# EAGLE board dashboard (EAGLE 8.0.1)
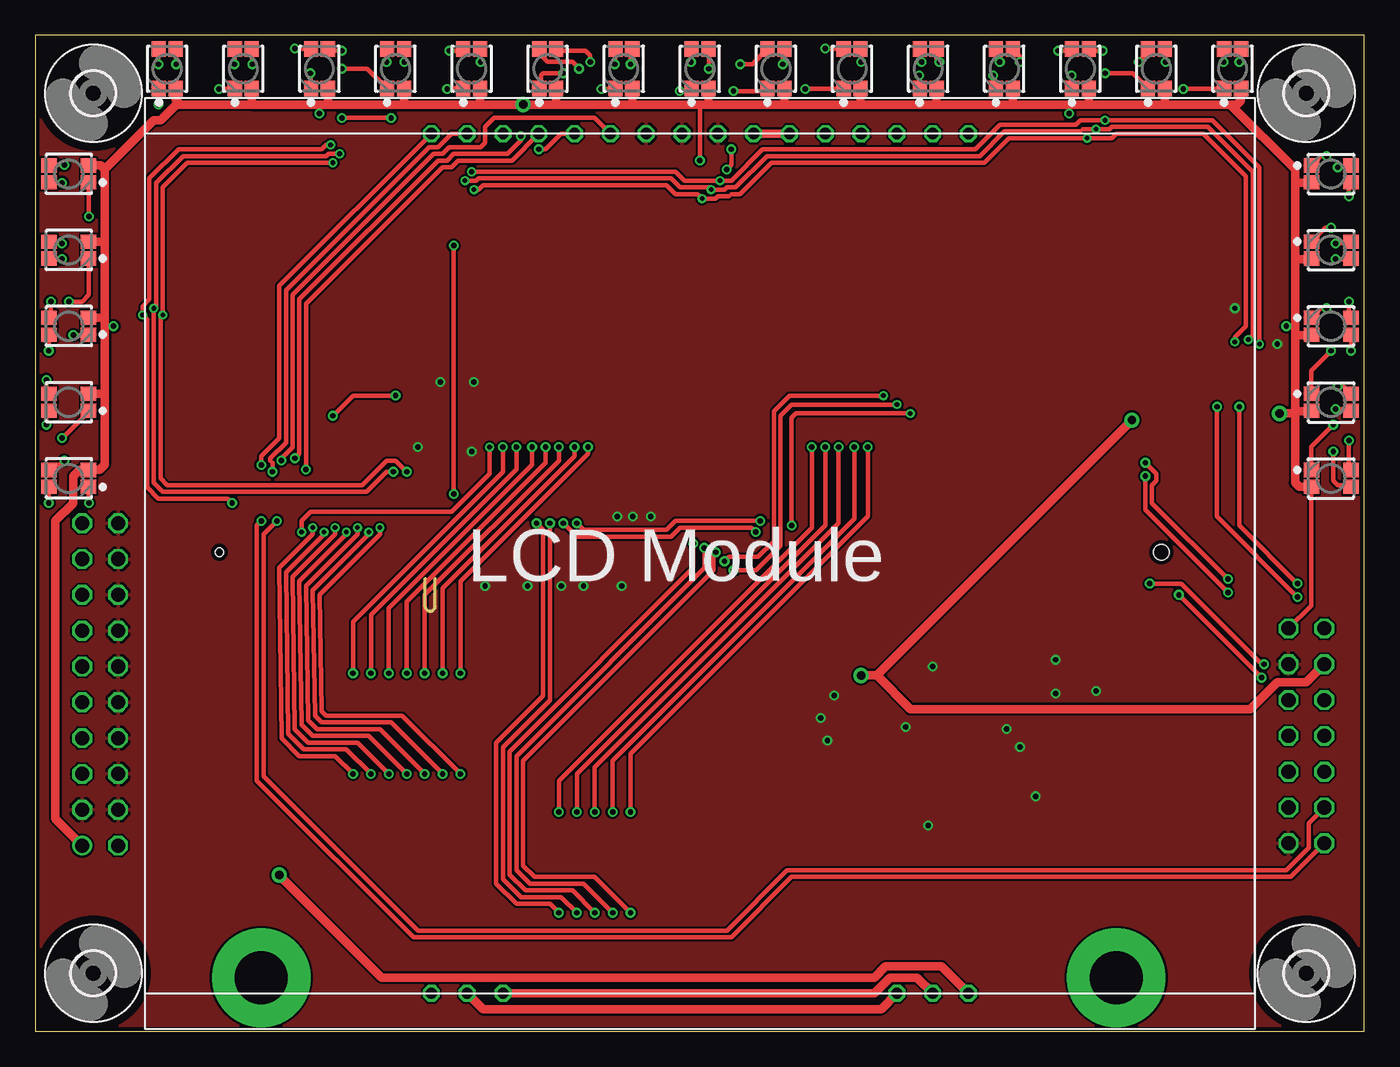
[diagram p3: board, top side]
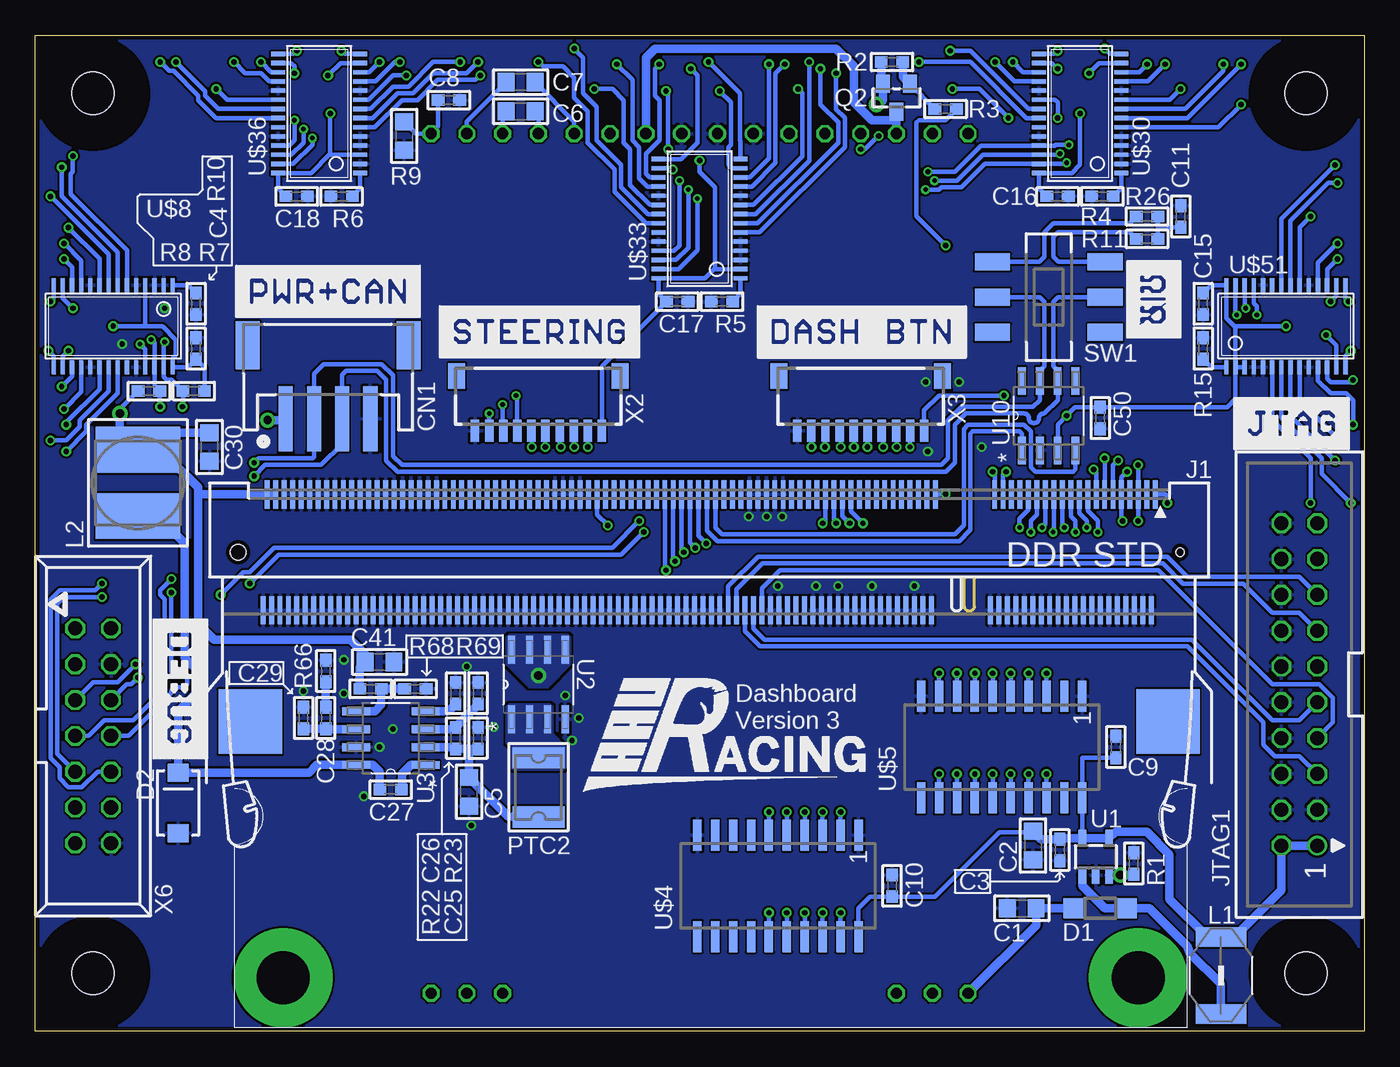
[diagram p4: board, bottom side, seen from below]

Size 94.27 x 70.64 mm. Coordinates in mm from the lower left corner, seen from the top.
Outline: 0,0 94.27,0 94.27,70.64 0,70.64 0,0
Copper layers (1*16): Top 0.035mm / dielectric 1.5mm / Bottom 0.035mm
Design rules "PCB-POOL Standard": minimum track width 0.15mm, minimum drill 0.3mm, track to track 0.15mm, track to pad 0.15mm, pad to pad 0.15mm, via to via 0.15mm, smd to smd 0.15mm, copper to edge 0.3mm, drill to drill 0.2mm, minimum pad ring 0.2mm, minimum via ring 0.15mm, stop-mask expansion 0.075mm, vias tented up to drill 0mil, thermal gap 0.2mm

## Footprints (pad centres in the part's own frame; a part is rotated, then mirrored left to right if it is on the bottom)
_0805 = smd 1.2 x 1.3: 1 -1.016,0; 2 1.016,0
_0603 = smd 0.9 x 0.8: 1 -0.762,0; 2 0.762,0
JSTPH4 = smd 1 x 4.6: 1 -3,-3.7; 2 -1,-3.7; 3 1,-3.7; 4 3,-3.7 | smd 1.7 x 3.4: NC1 -5.7,1.5; NC2 5.7,1.5
SOD123 = smd 1.4 x 1.4: A 1.9,0; C -1.9,0
SMA-DIODE = smd 1.27 x 1.47: A -2.15,0; C 2.15,0
3,0 = hole 3: 0,0
SODIMM-CONNECTOR-2.5V = smd 0.35 x 2: 1 28.84,18.07; 2 28.54,9.87; 3 28.24,18.07; 4 27.94,9.87; 5 27.64,18.07; 6 27.34,9.87; 7 27.04,18.07; 8 26.74,9.87; 9 26.44,18.07; 10 26.14,9.87; 11 25.84,18.07; 12 25.54,9.87; 13 25.24,18.07; 14 24.94,9.87; 15 24.64,18.07; 16 24.34,9.87; 17 24.04,18.07; 18 23.74,9.87; 19 23.44,18.07; 20 23.14,9.87; 21 22.84,18.07; 22 22.54,9.87; 23 22.24,18.07; 24 21.94,9.87; 25 21.64,18.07; 26 21.34,9.87; 27 21.04,18.07; 28 20.74,9.87; 29 20.44,18.07; 30 20.14,9.87; 31 19.84,18.07; 32 19.54,9.87; 33 19.24,18.07; 34 18.94,9.87; 35 18.64,18.07; 36 18.34,9.87; 37 18.04,18.07; 38 17.74,9.87; 39 17.44,18.07; 40 17.14,9.87; 41 13.24,18.07; 42 12.94,9.87; 43 12.64,18.07; 44 12.34,9.87; 45 12.04,18.07; 46 11.74,9.87; 47 11.44,18.07; 48 11.14,9.87; 49 10.84,18.07; 50 10.54,9.87; 51 10.24,18.07; 52 9.94,9.87; 53 9.64,18.07; 54 9.34,9.87; 55 9.04,18.07; 56 8.74,9.87; 57 8.44,18.07; 58 8.14,9.87; 59 7.84,18.07; 60 7.54,9.87; 61 7.24,18.07; 62 6.94,9.87; 63 6.64,18.07; 64 6.34,9.87; 65 6.04,18.07; 66 5.74,9.87; 67 5.44,18.07; 68 5.14,9.87; 69 4.84,18.07; 70 4.54,9.87; 71 4.24,18.07; 72 3.94,9.87; 73 3.64,18.07; 74 3.34,9.87; 75 3.04,18.07; 76 2.74,9.87; 77 2.44,18.07; 78 2.14,9.87; 79 1.84,18.07; 80 1.54,9.87; 81 1.24,18.07; 82 0.94,9.87; 83 0.64,18.07; 84 0.34,9.87; 85 0.04,18.07; 86 -0.26,9.87; 87 -0.56,18.07; 88 -0.86,9.87; 89 -1.16,18.07; 90 -1.46,9.87; 91 -1.76,18.07; 92 -2.06,9.87; 93 -2.36,18.07; 94 -2.66,9.87; 95 -2.96,18.07; 96 -3.26,9.87; 97 -3.56,18.07; 98 -3.86,9.87; 99 -4.16,18.07; 100 -4.46,9.87; 101 -4.76,18.07; 102 -5.06,9.87; 103 -5.36,18.07; 104 -5.66,9.87; 105 -5.96,18.07; 106 -6.26,9.87; 107 -6.56,18.07; 108 -6.86,9.87; 109 -7.16,18.07; 110 -7.46,9.87; 111 -7.76,18.07; 112 -8.06,9.87; 113 -8.36,18.07; 114 -8.66,9.87; 115 -8.96,18.07; 116 -9.26,9.87; 117 -9.56,18.07; 118 -9.86,9.87; 119 -10.16,18.07; 120 -10.46,9.87; 121 -10.76,18.07; 122 -11.06,9.87; 123 -11.36,18.07; 124 -11.66,9.87; 125 -11.96,18.07; 126 -12.26,9.87; 127 -12.56,18.07; 128 -12.86,9.87; 129 -13.16,18.07; 130 -13.46,9.87; 131 -13.76,18.07; 132 -14.06,9.87; 133 -14.36,18.07; 134 -14.66,9.87; 135 -14.96,18.07; 136 -15.26,9.87; 137 -15.56,18.07; 138 -15.86,9.87; 139 -16.16,18.07; 140 -16.46,9.87; 141 -16.76,18.07; 142 -17.06,9.87; 143 -17.36,18.07; 144 -17.66,9.87; 145 -17.96,18.07; 146 -18.26,9.87; 147 -18.56,18.07; 148 -18.86,9.87; 149 -19.16,18.07; 150 -19.46,9.87; 151 -19.76,18.07; 152 -20.06,9.87; 153 -20.36,18.07; 154 -20.66,9.87; 155 -20.96,18.07; 156 -21.26,9.87; 157 -21.56,18.07; 158 -21.86,9.87; 159 -22.16,18.07; 160 -22.46,9.87; 161 -22.76,18.07; 162 -23.06,9.87; 163 -23.36,18.07; 164 -23.66,9.87; 165 -23.96,18.07; 166 -24.26,9.87; 167 -24.56,18.07; 168 -24.86,9.87; 169 -25.16,18.07; 170 -25.46,9.87; 171 -25.76,18.07; 172 -26.06,9.87; 173 -26.36,18.07; 174 -26.66,9.87; 175 -26.96,18.07; 176 -27.26,9.87; 177 -27.56,18.07; 178 -27.86,9.87; 179 -28.16,18.07; 180 -28.46,9.87; 181 -28.76,18.07; 182 -29.06,9.87; 183 -29.36,18.07; 184 -29.66,9.87; 185 -29.96,18.07; 186 -30.26,9.87; 187 -30.56,18.07; 188 -30.86,9.87; 189 -31.16,18.07; 190 -31.46,9.87; 191 -31.76,18.07; 192 -32.06,9.87; 193 -32.36,18.07; 194 -32.66,9.87; 195 -32.96,18.07; 196 -33.26,9.87; 197 -33.56,18.07; 198 -33.86,9.87; 199 -34.16,18.07; 200 -34.46,9.87 | smd 4.5 x 4.6: M1 29.74,1.97; M2 -35.36,1.97 | drill 3.75 pad 7: P$1 -33.02,-16.192; P$2 27.622,-16.192 | hole 0.6: 30.59,13.97 | hole 1.1: -36.21,13.97
JTAG-ARM = drill 1: 1 -11.43,-1.27 | drill 1 octagon: 2 -11.43,1.27; 3 -8.89,-1.27; 4 -8.89,1.27; 5 -6.35,-1.27; 6 -6.35,1.27; 7 -3.81,-1.27; 8 -3.81,1.27; 9 -1.27,-1.27; 10 -1.27,1.27; 11 1.27,-1.27; 12 1.27,1.27; 13 3.81,-1.27; 14 3.81,1.27; 15 6.35,-1.27; 16 6.35,1.27; 17 8.89,-1.27; 18 8.89,1.27; 19 11.43,-1.27; 20 11.43,1.27
S = smd 1.4 x 3.56: 1 -2.73,0; 2 2.73,0
INDUCTOR_6X6MM_TDK_VLC6045 = smd 3.25 x 6: P$1 -2.35,0; P$2 2.35,0
RGBLED_PLCC4 = smd 1.1 x 1: 1 -1.4,0.6; 2 -1.4,-0.6; 3 1.4,-0.6; 4 1.4,0.6
PTC1812 = smd 1.5 x 3.7: P$1 -2.1,0; P$2 2.1,0
SOT23-WIDE = smd 1 x 1.27: 1 -0.95,-1; 2 0.95,-1; 3 0,1
DPDT_SMT_JS202011SCQN = smd 1.2 x 2.5: P$1 -2.5,-4; P$2 0,-4; P$3 2.5,-4; P$4 2.5,4; P$5 0,4; P$6 -2.5,4
SOT23-5 = smd 0.55 x 1.2: 1 -0.95,-1.3; 2 0,-1.3; 3 0.95,-1.3; 4 0.95,1.3; 5 -0.95,1.3
SOIC127P600X175-8N = smd 1.981 x 0.508: 1 -2.464,1.905; 2 -2.464,0.635; 3 -2.464,-0.635; 4 -2.464,-1.905; 5 2.464,-1.905; 6 2.464,-0.635; 7 2.464,0.635; 8 2.464,1.905
SOIC127P600X175-8N' = smd 1.981 x 0.559: 1 -2.464,1.905; 2 -2.464,0.635; 3 -2.464,-0.635; 4 -2.464,-1.905; 5 2.464,-1.905; 6 2.464,-0.635; 7 2.464,0.635; 8 2.464,1.905
SOP20 = smd 0.6 x 2.2: 1 -5.715,-3.6; 2 -4.445,-3.6; 3 -3.175,-3.6; 4 -1.905,-3.6; 5 -0.635,-3.6; 6 0.635,-3.6; 7 1.905,-3.6; 8 3.175,-3.6; 9 4.445,-3.6; 10 5.715,-3.6; 11 5.715,3.6; 12 4.445,3.6; 13 3.175,3.6; 14 1.905,3.6; 15 0.635,3.6; 16 -0.635,3.6; 17 -1.905,3.6; 18 -3.175,3.6; 19 -4.445,3.6; 20 -5.715,3.6
TSSOP28 = smd 0.305 x 0.991: 1 -4.225,-2.918; 2 -3.575,-2.918; 3 -2.925,-2.918; 4 -2.275,-2.918; 5 -1.625,-2.918; 6 -0.975,-2.918; 7 -0.325,-2.918; 8 0.325,-2.918; 9 0.975,-2.918; 10 1.625,-2.918; 11 2.275,-2.918; 12 2.925,-2.918; 13 3.575,-2.918; 14 4.225,-2.918; 15 4.225,2.918; 16 3.575,2.918; 17 2.925,2.918; 18 2.275,2.918; 19 1.625,2.918; 20 0.975,2.918; 21 0.325,2.918; 22 -0.325,2.918; 23 -0.975,2.918; 24 -1.625,2.918; 25 -2.275,2.918; 26 -2.925,2.918; 27 -3.575,2.918; 28 -4.225,2.918
EA-DOGXL160W-7 = drill 0.8 octagon: P$1 20.32,2.54; P$2 22.86,2.54; P$3 25.4,2.54; P$14 53.34,2.54; P$15 55.88,2.54; P$16 58.42,2.54; P$17 58.42,63.5; P$18 55.88,63.5; P$19 53.34,63.5; P$20 50.8,63.5; P$21 48.26,63.5; P$22 45.72,63.5; P$23 43.18,63.5; P$24 40.64,63.5; P$25 38.1,63.5; P$26 35.56,63.5; P$27 33.02,63.5; P$28 30.48,63.5; P$29 27.94,63.5; P$30 25.4,63.5; P$31 22.86,63.5; P$32 20.32,63.5
SM10B-SRSS-TB = smd 0.6 x 1.55: 1 -4.5,2.975; 2 -3.5,2.975; 3 -2.5,2.975; 4 -1.5,2.975; 5 -0.5,2.975; 6 0.5,2.975; 7 1.5,2.975; 8 2.5,2.975; 9 3.5,2.975; 10 4.5,2.975 | smd 1.2 x 1.8: FIT@1 -5.8,-0.9; FIT@2 5.8,-0.9
057-014-1 = drill 1 octagon: 1 -7.62,-1.27; 2 -7.62,1.27; 3 -5.08,-1.27; 4 -5.08,1.27; 5 -2.54,-1.27; 6 -2.54,1.27; 7 0,-1.27; 8 0,1.27; 9 2.54,-1.27; 10 2.54,1.27; 11 5.08,-1.27; 12 5.08,1.27; 13 7.62,-1.27; 14 7.62,1.27

## Placement (x,y rotation side)
C1  220n50V  [_0805]  24.29,8.73 180 bottom
C2  1u  [_0805]  23.5,13.18 270 bottom
C3  100n  [_0603]  21.59,12.86 270 bottom
C4  100n  [_0603]  82.87,48.42 90 bottom
C5  4,7u  [_0805]  63.5,16.99 270 bottom
C6  2u  [_0805]  59.85,65.25 180 bottom
C7  2u  [_0805]  59.85,67.31 180 bottom
C8  100n  [_0603]  64.93,66.04 180 bottom
C9  100n  [_0603]  17.62,20.16 90 bottom
C10  100n  [_0603]  33.5,10.32 90 bottom
C11  47n  [_0603]  13.02,57.78 90 bottom
C15  100n  [_0603]  11.43,51.59 270 bottom
C16  100n  [_0603]  21.75,59.21 0 bottom
C17  100n  [_0603]  48.74,51.75 0 bottom
C18  100n  [_0603]  75.72,59.21 0 bottom
C25  10n  [_0603]  62.87,20.8 90 bottom
C26  10n  [_0603]  64.45,23.97 90 bottom
C27  100n  [_0603]  69.06,17.14 0 bottom
C28  1n  [_0603]  73.66,22.23 90 bottom
C29  47p  [_0603]  75.25,22.23 90 bottom
C30  47u  [_0805]  81.92,41.43 270 bottom
C41  47u  [_0805]  69.85,26.19 0 bottom
C50  100n  [_0603]  18.73,43.5 270 bottom
CN1  [JSTPH4]  73.5,47.15 0 bottom
D1  MBR0520LT  [SOD123]  18.73,8.73 0 bottom
D2  BA340A  [SMA-DIODE]  84.14,16.19 90 bottom
H1  MOUNT-HOLE3.0  [3,0]  4.13,4.13 0 top
H2  MOUNT-HOLE3.0  [3,0]  90.17,4.13 0 top
H3  MOUNT-HOLE3.0  [3,0]  90.17,66.52 0 top
H4  MOUNT-HOLE3.0  [3,0]  4.13,66.52 0 top
J1  SO-DIMM-CPU  [SODIMM-CONNECTOR-2.5V]  43.66,20 0 bottom
JTAG1  JTAG-ARM  [JTAG-ARM]  4.6,24.61 90 bottom
L1  WE-PD4S  [S]  10.16,3.97 90 bottom
L2  SRN6045TA-680M  [INDUCTOR_6X6MM_TDK_VLC6045]  87,38.89 90 bottom
LED1  [RGBLED_PLCC4]  9.37,68.26 90 top
LED2  [RGBLED_PLCC4]  14.76,68.26 90 top
LED3  [RGBLED_PLCC4]  20.16,68.26 90 top
LED4  [RGBLED_PLCC4]  25.56,68.26 90 top
LED5  [RGBLED_PLCC4]  30.96,68.26 90 top
LED6  [RGBLED_PLCC4]  36.35,68.26 90 top
LED7  [RGBLED_PLCC4]  41.75,68.26 90 top
LED8  [RGBLED_PLCC4]  47.15,68.26 90 top
LED9  [RGBLED_PLCC4]  52.55,68.26 90 top
LED10  [RGBLED_PLCC4]  57.94,68.26 90 top
LED11  [RGBLED_PLCC4]  63.34,68.26 90 top
LED12  [RGBLED_PLCC4]  68.74,68.26 90 top
LED13  [RGBLED_PLCC4]  74.14,68.26 90 top
LED14  [RGBLED_PLCC4]  79.53,68.26 90 top
LED15  [RGBLED_PLCC4]  84.93,68.26 90 top
LED16  [RGBLED_PLCC4]  2.38,39.21 180 top
LED17  [RGBLED_PLCC4]  2.38,44.61 180 top
LED18  [RGBLED_PLCC4]  2.38,50.01 180 top
LED19  [RGBLED_PLCC4]  2.38,55.4 180 top
LED20  [RGBLED_PLCC4]  2.38,60.8 180 top
LED21  [RGBLED_PLCC4]  91.92,60.8 0 top
LED22  [RGBLED_PLCC4]  91.92,55.4 0 top
LED23  [RGBLED_PLCC4]  91.92,50.01 0 top
LED24  [RGBLED_PLCC4]  91.92,44.61 0 top
LED25  [RGBLED_PLCC4]  91.92,39.21 0 top
PTC2  [PTC1812]  58.58,17.3 90 bottom
Q2  [SOT23-WIDE]  33.18,66.2 180 bottom
R1  15  [_0603]  16.35,11.91 90 bottom
R2  1k  [_0603]  33.5,68.74 0 bottom
R3  220  [_0603]  29.69,65.41 0 bottom
R4  931  [_0603]  18.57,59.21 180 bottom
R5  931  [_0603]  45.56,51.75 180 bottom
R6  931  [_0603]  72.55,59.21 180 bottom
R7  500  [_0603]  83.03,45.4 0 bottom
R8  500  [_0603]  86.2,45.4 180 bottom
R9  10m  [_0805]  68.1,63.5 90 bottom
R10  931  [_0603]  82.87,51.59 270 bottom
R11  60  [_0603]  15.4,56.2 0 bottom
R15  931  [_0603]  11.43,48.42 90 bottom
R22  332k  [_0603]  64.45,20.8 90 bottom
R23  68k1  [_0603]  62.87,23.97 90 bottom
R26  60  [_0603]  15.4,57.78 180 bottom
R66  29k4  [_0603]  73.66,25.56 90 bottom
R68  10k2  [_0603]  70.48,24.29 0 bottom
R69  3k24  [_0603]  67.31,24.29 0 bottom
SW1  [DPDT_SMT_JS202011SCQN]  22.38,52.07 90 bottom
U1  CAT4238TD-GT3  [SOT23-5]  19.05,12.38 0 bottom
U2  IRF9332PBF  [SOIC127P600X175-8N]  58.58,24.61 90 bottom
U3  TPS54331D  [SOIC127P600X175-8N']  69.06,20.8 180 bottom
U10  SN65HVD232D  [SOIC127P600X175-8N']  22.38,43.66 90 bottom
U$4  MAX6818  [SOP20]  41.59,10.32 180 bottom
U$5  MAX6818  [SOP20]  25.72,20.16 180 bottom
U$8  TLC59116  [TSSOP28]  88.74,50.01 180 bottom
U$10  EA-DOGXL160W-7  [EA-DOGXL160W-7]  7.78,0.16 0 top
U$30  TLC59116  [TSSOP28]  20.16,65.09 90 bottom
U$33  TLC59116  [TSSOP28]  47.15,57.63 90 bottom
U$36  TLC59116  [TSSOP28]  74.14,65.09 90 bottom
U$51  TLC59116  [TSSOP28]  5.56,50.01 0 bottom
X2  SM10B-SRSS-TB  [SM10B-SRSS-TB]  58.58,45.56 180 bottom
X3  SM10B-SRSS-TB  [SM10B-SRSS-TB]  35.72,45.56 180 bottom
X6  057-014-1  [057-014-1]  90.17,20.95 270 bottom

## Tracks (layer width: path | path; a pad name or v marks a point on that pad's centre or on a via)
3.3V  (via drill 0.38, 0.6)
  Top 0.305: v73.34,65.09 73.34,65.72 | v47.15,61.75 47.15,65.72 | v5.56,50.01 4.92,50.01 | X6.2 90.52,30.19 LED25.2 | v20.16,65.09 20.16,65.72 | v88.74,50.01 89.38,50.01 | v25.56,45.09 22.54,45.09 v21.11,43.66
  Top 0.61: 10.32,65.72 9.97,66.08 LED1.2 | 74.74,65.72 73.34,65.72 69.34,65.72 | 80.13,65.72 74.74,65.72 | 63.94,65.72 69.34,65.72 | 58.54,65.72 63.94,65.72 | 53.15,65.72 58.54,65.72 | 47.75,65.72 53.15,65.72 | 42.86,65.72 47.15,65.72 47.75,65.72 | 42.86,65.72 42.35,65.72 | 36.95,65.72 42.35,65.72 | 31.56,65.72 v34.61,65.72 36.95,65.72 | 26.51,65.72 26.16,65.72 | 26.51,65.72 31.56,65.72 | 20.76,65.72 26.16,65.72 | 15.36,65.72 20.16,65.72 20.76,65.72 | 15.36,65.72 10.32,65.72 | 84.77,65.72 80.13,65.72 | 84.77,65.72 85.25,65.72 85.53,66 LED15.2 | JTAG1.1 1.43,15.08 1.43,36.2 2.7,37.47 2.7,39.37 3.14,39.81 LED16.2 4.57,39.81 4.92,40.16 4.92,45.21 | 4.92,56 4.92,61.12 | 4.92,50.61 4.92,56 | 4.92,45.21 4.92,50.01 4.92,50.61 | 4.92,61.12 8.41,64.61 8.89,64.61 10,65.72 10.32,65.72 | LED20.2 4.64,61.4 4.92,61.12 | LED19.2 4.92,56 | LED18.2 4.92,50.61 | LED17.2 4.92,45.21 | LED25.2 89.66,38.61 89.38,38.89 89.38,43.97 | 89.38,54.77 89.38,60.17 | 89.38,49.37 89.38,50.01 89.38,54.77 | 89.38,43.97 89.38,49.37 | 89.38,60.17 89.38,61.12 84.77,65.72 | LED21.2 90.48,60.17 89.38,60.17 | LED22.2 90.48,54.77 89.38,54.77 | LED23.2 90.48,49.37 89.38,49.37 | LED24.2 90.48,43.97 89.38,43.97 | v88.27,43.81 89.22,43.81 89.38,43.97 | LED2.2 15.36,65.72 | LED3.2 20.76,65.72 | LED4.2 26.16,65.72 | 26.16,65.72 26.51,65.72 | LED5.2 31.56,65.72 | LED6.2 36.95,65.72 | LED7.2 42.35,65.72 | 42.35,65.72 42.86,65.72 | LED8.2 47.75,65.72 | LED9.2 53.15,65.72 | LED10.2 58.54,65.72 | LED11.2 63.94,65.72 | LED12.2 69.34,65.72 | LED13.2 74.74,65.72 | LED14.2 80.13,65.72
  Bottom 0.305: 46.04,54.05 46.11,54.05 46.76,53.4 U$33.28 50.07,52.32 C17.1 54.08,47.17 X2.1 | 46.04,54.05 U$33.2 | 9.21,50.01 9.78,50.58 U$51.28 10.86,52.92 C15.1 | 9.21,50.01 v5.56,50.01 | U$51.2 9.13,49.93 9.21,50.01 | U$51.3 U$51.2 | C18.1 77.05,59.78 U$36.28 74.71,60.86 73.34,62.23 | U$4.20 35.88,8.73 35.05,9.56 C10.1 30.45,9.56 25.88,14.13 23.56,14.13 C2.1 | C9.1 20,19.4 U$5.20 U1.5 | C16.1 23.08,59.78 U$30.28 20.73,60.86 20.16,61.44 v20.16,65.09 | 73.34,62.23 v73.34,65.09 | U$36.3 73.28,62.16 73.34,62.23 | v47.15,61.75 47.15,60.96 46.04,59.85 46.04,54.05 | 86.47,50.01 85.25,50.01 84.3,49.05 84.3,47.94 84.52,47.72 U$8.28 83.44,47.09 C4.1 82.26,47.05 R7.2 | 86.47,50.01 v88.74,50.01 | U$8.4 86.47,50.01 | R8.2 87,45.4 88.27,44.13 v88.27,43.81 | U10.3 21.75,43.02 v21.11,43.66 20.51,44.26 C50.1 9.72,44.26 9.13,44.84 U$51.2 | v25.56,45.09 30.16,45.09 31.22,44.03 X3.1
  Bottom 0.406: J1.197 J1.199
  Bottom 0.61: v34.61,65.72 34.45,65.72 34.13,66.04 Q2.2 34.26,67.33 R2.1 | C2.1 22.92,13.62 C3.1 21.53,13.68 U1.5 U1.4 17.62,14.16 15.43,14.16 13.81,12.54 13.81,9.37 11.14,6.7 L1.2 9.18,6.7 5.87,10 JTAG1.2 JTAG1.1 | v88.27,43.81 88.27,42.51 L2.P$2 | R68.1 71.25,25.81 C41.1 70.87,26.73 71.91,27.78 81.6,27.78 82.71,28.89 82.71,38.1 | 82.71,38.1 82.71,38.58 84.61,40.48 86.23,40.48 L2.P$2 | 82.71,38.1 82.68,38.07 J1.199 | C30.1 85.79,42.45 L2.P$2
12V
  Bottom 0.61: U3.2 64.58,20.16 R22.1 63.66,20.03 | 63.66,20.03 C25.1 62.83,20 | 63.66,20.03 63.5,19.88 C5.1 60.7,15.2 PTC2.P$1
BTN1  (via drill 0.38)
  Top 0.305: v37.15,8.41 36.51,9.05 34.13,9.05 32.7,10.48 32.7,20.48 36.04,23.81 36.04,35.56 v35.56,36.04
  Bottom 0.305: U$4.19 v37.15,8.41 | J1.61 36.42,36.89 v35.56,36.04
BTN2  (via drill 0.38)
  Top 0.305: v38.42,8.41 37.31,9.53 34.45,9.53 33.18,10.79 33.18,20.16 36.51,23.5 v36.51,36.04
  Bottom 0.305: U$4.18 v38.42,8.41 | J1.63 37.02,36.54 v36.51,36.04
BTN3  (via drill 0.38)
  Top 0.305: v39.69,8.41 38.1,10 34.77,10 33.66,11.11 33.66,19.84 46.67,32.86 v46.67,34.61
  Bottom 0.305: U$4.17 v39.69,8.41 | J1.97 47.22,35.15 v46.67,34.61
BTN4  (via drill 0.38)
  Top 0.305: v40.96,8.41 38.89,10.48 35.08,10.48 34.13,11.43 34.13,19.53 47.47,32.86 v47.47,34.29
  Bottom 0.305: U$4.16 v40.96,8.41 | J1.99 47.82,34.64 v47.47,34.29
BTN5  (via drill 0.38)
  Top 0.305: v42.23,8.41 39.69,10.95 35.4,10.95 34.61,11.75 34.61,19.21 48.1,32.7 48.1,33.81 v48.26,33.97
  Bottom 0.305: U$4.15 v42.23,8.41 | J1.101 48.42,34.13 v48.26,33.97
BTN6  (via drill 0.33, 0.38)
  Top 0.305: v48.9,33.34 49.21,33.66 51.28,33.66 52.39,34.77 52.39,43.97 53.5,45.09 v60.17,45.09
  Bottom 0.305: J1.103 49.02,33.46 v48.9,33.34 | v60.17,45.09 60.08,45 X2.7
BTN7  (via drill 0.33, 0.38)
  Top 0.305: v49.53,32.7 51.12,32.7 52.86,34.45 52.86,43.66 53.66,44.45 v61.12,44.45
  Bottom 0.305: J1.105 49.62,32.79 v49.53,32.7 | v61.12,44.45 61.12,42.63 X2.8
BTN8  (via drill 0.33, 0.38)
  Top 0.305: v53.66,35.88 53.66,43.5 53.98,43.81 v62.07,43.81
  Bottom 0.305: J1.121 54.42,36.64 v53.66,35.88 | X2.9 v62.08,43.81 v62.07,43.81
CAN_RX
  Bottom 0.305: J1.93 46.02,35.7 45.56,35.24 29.05,35.24 28.42,35.88 28.42,42.7 28.1,43.02 24.13,43.02 23.65,42.55 23.65,40.01 23.34,39.69 20.64,39.69 20.48,39.85 U10.4
CAN_TX
  Bottom 0.305: J1.95 46.62,35.5 45.88,34.77 28.73,34.77 27.94,35.56 27.94,42.39 27.78,42.55 24.45,42.55 24.29,42.39 U10.1
CANH  (via drill 0.38)
  Top 0.305: v84.61,32.07 79.22,37.47 79.22,38.73 79.53,39.05 79.53,39.53 v78.74,40.32
  Bottom 0.305: SW1.P$5 23.02,52.07 22.7,51.75 22.7,47.15 23.02,46.83 U10.7 23.02,44.77 23.5,44.29 28.57,44.29 29.53,43.34 29.53,40.64 30,40.16 68.26,40.16 68.9,40.8 68.9,46.51 69.69,47.31 73.82,47.31 74.5,46.62 CN1.2 74.5,40.75 74.61,40.64 78.42,40.64 v78.74,40.32 | X6.7 90.49,20.95 89.38,22.07 87.31,22.07 85.09,24.29 85.09,30.64 85.41,30.96 85.41,31.27 v84.61,32.07
CANL  (via drill 0.38)
  Top 0.305: v78.74,39.37 78.74,36.99 v84.61,31.11
  Bottom 0.305: SW1.P$2 21.75,52.07 22.07,51.75 22.07,47.15 21.75,46.83 U10.6 21.75,44.77 22.7,43.81 22.74,43.81 arc-90 23.08,43.48 arc90 23.42,43.13 23.45,43.13 arc90 23.79,43.48 arc-90 24.13,43.81 28.26,43.81 29.05,43.02 29.05,40.32 29.69,39.69 68.58,39.69 69.37,40.48 69.37,46.2 70.01,46.83 72.23,46.83 72.5,46.56 CN1.3 72.5,41.64 73.98,40.16 77.95,40.16 v78.74,39.37 | X6.8 87.63,20.95 84.61,23.97 84.61,24.07 arc90 84.27,24.41 83.82,24.41 arc-90 83.48,24.75 83.48,24.88 arc-90 83.82,25.22 84.27,25.22 arc90 84.61,25.56 v84.61,31.11
CD  (via drill 0.38)
  Top 0.305: v17.46,40.48 17.46,40.64 18.26,41.43 18.26,52.23 28.26,62.23 28.89,62.23 29.37,62.71 31.59,62.71 31.91,63.02 31.91,64.14 32.54,64.77 39.69,64.77 U$10.P$27
  Bottom 0.305: J1.11 17.82,40.13 v17.46,40.48
DBG_RX  (via drill 0.38)
  Top 0.305: v81.12,30.96 v87,25.08 | v51.44,36.2 45.4,36.2 44.77,35.56 38.89,35.56 v38.42,36.04
  Bottom 0.305: J1.67 38.22,36.24 v38.42,36.04 | v87,25.08 87.47,24.61 87.79,24.61 X6.6 | v81.12,30.96 79.53,32.54 79.06,32.54 77.31,34.29 53.34,34.29 v51.44,36.2
DBG_TX  (via drill 0.38)
  Top 0.305: v51.12,35.4 50.8,35.72 45.72,35.72 45.09,35.08 38.42,35.08 v37.47,36.04 | v79.06,31.75 81.28,31.75 87,26.04 v87.15,26.04
  Bottom 0.305: J1.65 37.62,36.19 v37.47,36.04 | v87.15,26.04 88.42,24.77 90.17,24.77 X6.5 | v79.06,31.75 76.99,33.81 52.7,33.81 v51.12,35.4
GND  (via drill 0.38)
  other vias: 85.09,51.28 88.11,48.74 43.66,36.51 41.27,36.51 42.39,36.51 41.59,31.59 38.89,31.59 37.31,31.59 34.92,31.59 31.91,31.59 56.67,23.81 72.39,26.35 72.39,23.97 69.85,20.16 68.9,21.43 75.25,24.13 61.75,21.59 63.34,14.61 70.96,16.67 63.66,25.88 55.72,22.23 56.2,20.64 31.11,46.04 28.73,46.04 30.96,41.12 27.15,41.43
  pour Top: 0,0 94.3,0 94.3,70.64 0,70.64
  pour Bottom (rank 2): 0,0 94.3,0 94.3,70.64 0,70.64
JTAG_TCK
  Bottom 0.305: JTAG1.9 4.6,22.07 6.51,22.07 12.22,27.78 42.55,27.78 43.32,28.55 J1.84
JTAG_TDI
  Bottom 0.305: JTAG1.5 4.6,19.53 6.35,19.53 7.14,20.32 7.14,21.91 12.54,27.3 42.86,27.3 43.92,28.36 J1.86
JTAG_TDO
  Bottom 0.305: JTAG1.13 4.6,29.69 6.51,29.69 8.57,31.75 12.86,31.75 14.29,33.18 42.7,33.18 44.52,31.37 J1.88
JTAG_TMS
  Bottom 0.305: JTAG1.7 2.22,21.91 2.22,23.65 3.17,24.61 6.51,24.61 14.61,32.7 41.43,32.7 42.72,31.42 J1.82
LCD_CLOCK  (via drill 0.38)
  Top 0.305: v16.03,40.16 16.03,40.8 17.3,42.07 17.3,52.86 U$10.P$32 | X6.13 89.06,10.95 53.66,10.95 49.37,6.67 26.83,6.67 15.72,17.78 15.72,35.88 v16.03,36.2
  Bottom 0.305: v16.03,40.16 16.02,40.15 J1.5 16.02,36.21 v16.03,36.2
LCD_CS  (via drill 0.38)
  Top 0.305: v18.41,40.64 18.73,40.96 18.73,51.91 28.57,61.75 29.21,61.75 29.69,62.23 33.5,62.23 34.45,63.18 v34.45,63.5 | v35.72,62.55 36.2,62.55 37.31,63.66 U$10.P$28
  Bottom 0.305: J1.13 18.42,39.84 v18.41,40.64 | v34.45,63.5 35.4,62.55 v35.72,62.55
LCD_DATA  (via drill 0.38)
  Top 0.305: U$10.P$31 29.53,63.66 28.57,62.71 27.94,62.71 17.78,52.55 17.78,41.75 16.67,40.64 16.67,40.48 16.83,40.32 v16.83,39.69 | X6.11 90.33,14.76 90.33,13.02 88.74,11.43 53.34,11.43 49.05,7.14 27.15,7.14 16.19,18.1 16.19,35.24 v17.14,36.2
  Bottom 0.305: v16.83,39.69 17.22,39.3 J1.9 17.22,36.27 v17.14,36.2
LCD_PWR_SW  (via drill 0.38)
  Top 0.305: v29.69,38.1 v29.69,55.72
  Bottom 0.305: R3.2 29.72,64.61 31.59,64.61 31.75,64.45 31.75,57.78 v29.69,55.72 | J1.41 29.71,38.07 v29.69,38.1
LCD_RESET  (via drill 0.38)
  Top 0.305: v19.21,39.85 19.21,51.59 28.89,61.28 29.53,61.28 30,61.75 33.81,61.75 U$10.P$29
  Bottom 0.305: J1.15 19.02,39.65 v19.21,39.85
N$1
  Top 0.61: U$10.P$2 31.75,1.59 60.01,1.59 U$10.P$14
N$2
  Top 0.61: U$10.P$3 59.53,2.7 60.64,3.81 62.55,3.81 U$10.P$15
N$3  (via drill 0.6)
  Top 0.61: U$10.P$16 64.29,4.6 60.33,4.6 59.53,3.81 24.58,3.81 v17.3,11.08
  Bottom 0.61: R1.1 16.41,11.08 v17.3,11.08 U1.3
N$4
  Bottom 0.61: D1.C C1.1 23.27,7.53 U$10.P$1
N$5
  Bottom 0.61: L1.1 10.19,1.27 10.19,3.37 12.38,5.56 12.54,6.03 15.24,8.73 D1.A 18.41,8.73 20,10.32 U1.1
N$6
  Top 0.61: U$10.P$22 U$10.P$23
  Bottom 0.61: 33.18,64.61 Q2.3 | 33.18,64.61 U$10.P$30 | 33.18,64.61 34.92,64.61 36.2,65.88 36.2,68.42 37.47,69.69 50.32,69.69 50.96,69.06 U$10.P$23
N$7  (via drill 0.38)
  Top 0.305: v8.73,65.72 8.73,66.83 LED1.1
  Bottom 0.305: U$30.6 10.34,64.11 v8.73,65.72
N$8  (via drill 0.38)
  Top 0.305: v8.73,68.58 8.73,69.63 LED1.4
  Bottom 0.305: U$30.7 12.55,64.76 v8.73,68.58
N$9
  Bottom 0.305: R3.1 32.23,67.19 Q2.1
  Bottom 0.61: Q2.1 32.73,67.7 R2.2
N$10  (via drill 0.38)
  Top 0.305: v10,68.58 10,69.63 LED1.3
  Bottom 0.305: U$30.8 12.69,65.41 10,68.1 v10,68.58
N$11  (via drill 0.38)
  Top 0.305: v13.02,66.83 14.13,66.83 LED2.1
  Bottom 0.305: U$30.9 13.79,66.06 v13.02,66.83
N$12  (via drill 0.38)
  Top 0.305: v14.13,68.58 14.13,69.63 LED2.4
  Bottom 0.305: U$30.11 15.35,67.36 v14.13,68.58
N$13  (via drill 0.38)
  Top 0.305: v15.4,68.58 15.4,69.63 LED2.3
  Bottom 0.305: U$30.12 15.97,68.01 v15.4,68.58
N$14  (via drill 0.38)
  Top 0.305: v19.53,67.94 19.53,66.9 LED3.1
  Bottom 0.305: U$30.13 18.81,68.66 v19.53,67.94
N$15  (via drill 0.38)
  Top 0.305: v18.41,69.69 19.53,69.69 LED3.4
  Bottom 0.305: U$30.14 18.04,69.31 v18.41,69.69
N$16  (via drill 0.38)
  Top 0.305: v21.75,69.53 20.89,69.53 LED3.3
  Bottom 0.305: U$30.15 21.97,69.31 v21.75,69.53
N$17  (via drill 0.38)
  Top 0.305: v21.75,68.26 23.56,68.26 LED4.1
  Bottom 0.305: U$30.16 22.15,68.66 v21.75,68.26
N$18  (via drill 0.38)
  Top 0.305: v24.92,68.74 24.92,69.63 LED4.4
  Bottom 0.305: U$30.17 24.2,68.01 v24.92,68.74
N$19  (via drill 0.38)
  Top 0.305: v26.19,68.74 26.19,69.63 LED4.3
  Bottom 0.305: U$30.18 24.82,67.36 v26.19,68.74
N$20  (via drill 0.38)
  Top 0.305: v21.75,64.77 v25.24,64.77 | v29.21,66.83 29.24,66.86 LED5.1
  Bottom 0.305: U$30.20 21.93,66.06 21.75,65.88 v21.75,64.77 | v25.24,64.77 27.3,66.83 v29.21,66.83
N$21  (via drill 0.38)
  Top 0.305: v29.37,69.53 30.23,69.53 LED5.4
  Bottom 0.305: U$30.21 23.82,65.41 27.94,69.53 v29.37,69.53
N$22  (via drill 0.38)
  Top 0.305: v31.59,68.74 31.56,68.77 LED5.3
  Bottom 0.305: U$30.22 23.96,64.76 27.94,68.74 v31.59,68.74
N$23  (via drill 0.38)
  Top 0.305: v37.47,67.94 36.04,67.94 35.88,67.79 35.88,66.99 LED6.1
  Bottom 0.305: U$33.6 42.88,56.65 36.83,62.71 36.83,64.77 37.47,65.41 v37.47,67.94
N$24  (via drill 0.38)
  Top 0.305: 35.88,69.54 LED6.4 35.75,69.34 36.35,68.74 38.1,68.74 v38.58,68.26
  Bottom 0.305: U$33.7 43.03,57.3 37.31,63.02 37.31,64.45 38.58,65.72 v38.58,68.26
N$25  (via drill 0.38)
  Top 0.305: v39.37,68.74 39.37,69.22 39.05,69.53 37.08,69.53 LED6.3
  Bottom 0.305: U$33.8 43.17,57.95 39.37,61.75 v39.37,68.74
N$26  (via drill 0.38)
  Top 0.305: v40.16,66.83 41.12,66.83 LED7.1
  Bottom 0.305: U$33.9 43.32,58.6 39.85,62.07 39.85,66.52 v40.16,66.83
N$27  (via drill 0.38)
  Top 0.305: v41.12,68.58 41.12,69.63 LED7.4
  Bottom 0.305: U$33.11 43.45,59.9 41.75,61.59 41.75,67.94 v41.12,68.58
N$28  (via drill 0.38)
  Top 0.305: v42.23,68.58 42.23,69.54 LED7.3
  Bottom 0.305: U$33.12 43.59,60.55 42.23,61.91 v42.23,68.58
N$29  (via drill 0.38)
  Top 0.305: v45.72,66.67 46.36,66.67 LED8.1
  Bottom 0.305: U$33.13 44.85,61.2 45.09,61.44 45.09,62.71 44.93,62.87 44.93,65.88 v45.72,66.67
N$30  (via drill 0.38)
  Top 0.305: v46.51,68.74 46.51,69.63 LED8.4
  Bottom 0.305: U$33.14 44.23,63.12 44.29,63.18 44.29,66.52 v46.51,68.74
N$31  (via drill 0.38)
  Top 0.305: v47.78,68.26 47.78,69.63 LED8.3
  Bottom 0.305: U$33.15 48.48,61.85 47.31,63.02 47.31,67.79 v47.78,68.26
N$32  (via drill 0.38)
  Top 0.305: v49.53,66.67 51.76,66.67 LED9.1 | v49.37,62.55 49.37,61.44 v49.05,61.12
  Bottom 0.305: U$33.16 49.14,61.2 v49.05,61.12 | v49.37,62.55 49.37,66.52 v49.53,66.67
N$33  (via drill 0.38)
  Top 0.305: v50.01,68.58 50.86,68.58 LED9.4
  Bottom 0.305: U$33.17 50.71,60.55 50.96,60.8 50.96,62.23 50.01,63.18 50.01,66.04 50.32,66.36 50.32,68.26 v50.01,68.58
N$34  (via drill 0.38)
  Top 0.305: v53.02,68.58 53.02,69.54 LED9.3
  Bottom 0.305: U$33.18 50.85,59.9 51.44,60.48 51.44,62.71 51.91,63.18 51.91,67.47 v53.02,68.58
N$35  (via drill 0.38)
  Top 0.305: v54.61,66.83 57.31,66.83 LED10.1
  Bottom 0.305: U$33.20 50.66,58.6 52.07,60.01 52.07,62.55 52.55,63.02 52.55,66.04 53.34,66.83 v54.61,66.83
N$36  (via drill 0.38)
  Top 0.305: v56.04,69.69 57.31,69.69 LED10.4
  Bottom 0.305: U$33.21 50.81,57.95 52.7,59.85 52.7,61.44 54.45,63.18 54.45,65.56 55.4,66.52 55.4,69.06 v56.04,69.69
N$37  (via drill 0.38)
  Top 0.305: v58.58,68.74 58.58,69.63 LED10.3
  Bottom 0.305: U$33.22 50.95,57.3 53.18,59.53 53.18,61.12 55.09,63.02 55.09,65.25 56.04,66.2 56.04,67.63 56.83,68.42 58.26,68.42 v58.58,68.74
N$38  (via drill 0.38)
  Top 0.305: v62.71,67.79 62.71,66.9 LED11.1
  Bottom 0.305: U$36.6 70.19,64.11 68.26,66.04 67.15,66.04 65.72,67.47 63.02,67.47 v62.71,67.79
N$39  (via drill 0.38)
  Top 0.305: v62.87,68.74 62.87,69.54 LED11.4
  Bottom 0.305: U$36.7 70.33,64.76 68.58,66.52 67.47,66.52 66.04,67.94 63.66,67.94 v62.87,68.74
N$40  (via drill 0.38)
  Top 0.305: v64.14,68.74 63.94,68.93 LED11.3
  Bottom 0.305: U$36.8 70.48,65.41 68.9,66.99 67.79,66.99 66.04,68.74 v64.14,68.74
N$41  (via drill 0.38)
  Top 0.305: v67.94,67.79 67.94,67.06 LED12.1
  Bottom 0.305: U$36.9 70.62,66.06 68.9,67.79 v67.94,67.79
N$42  (via drill 0.38)
  Top 0.305: v68.42,68.74 68.42,69.38 LED12.4
  Bottom 0.305: U$36.11 70.11,67.36 68.74,68.74 v68.42,68.74
N$43  (via drill 0.38)
  Top 0.305: v69.85,68.74 69.85,69.15 LED12.3
  Bottom 0.305: U$36.12 70.58,68.01 v69.85,68.74
N$44  (via drill 0.38)
  Top 0.305: v73.5,67.79 73.5,66.9 LED13.1
  Bottom 0.305: U$36.13 72.62,68.66 v73.5,67.79
N$45  (via drill 0.38)
  Top 0.305: v72.55,69.53 73.41,69.53 LED13.4
  Bottom 0.305: U$36.14 72.33,69.31 v72.55,69.53
N$46  (via drill 0.38)
  Top 0.305: v75.72,69.53 74.87,69.53 LED13.3
  Bottom 0.305: U$36.15 75.94,69.31 v75.72,69.53
N$47  (via drill 0.38)
  Top 0.305: v75.88,67.94 77.85,67.94 LED14.1
  Bottom 0.305: U$36.16 76.12,68.66 75.88,68.42 v75.88,67.94
N$48  (via drill 0.38)
  Top 0.305: v78.26,68.74 78.93,69.41 LED14.4
  Bottom 0.305: U$36.17 77.54,68.01 v78.26,68.74
N$49  (via drill 0.38)
  Top 0.305: v80.17,68.74 80.17,69.63 LED14.3
  Bottom 0.305: U$36.18 77.68,67.36 78.26,67.94 79.38,67.94 v80.17,68.74
N$50  (via drill 0.38)
  Top 0.305: v81.44,66.83 84.3,66.83 LED15.1
  Bottom 0.305: U$36.20 80.67,66.06 v81.44,66.83
N$51  (via drill 0.38)
  Top 0.305: v84.3,68.74 84.3,69.63 LED15.4
  Bottom 0.305: U$36.21 81.29,65.41 82.23,66.36 82.23,66.67 v84.3,68.74
N$52  (via drill 0.38)
  Top 0.305: v85.41,68.74 85.53,68.86 LED15.3
  Bottom 0.305: U$36.22 81.43,64.76 82.71,66.04 82.71,66.36 84.45,68.1 84.77,68.1 v85.41,68.74
N$53
  Bottom 0.305: U$30.1 17.24,59.78 R4.1
N$54  (via drill 0.38)
  Top 0.305: v3.81,37.47 3.81,38.58 LED16.1
  Bottom 0.305: U$51.6 6.53,43.36 3.81,40.64 v3.81,37.47
N$55
  Bottom 0.305: U$33.1 44.23,52.32 R5.1
N$56
  Bottom 0.305: U$36.1 71.22,59.78 R6.1
N$57
  Bottom 0.305: C6.1 58.58,64.99 U$10.P$20
N$58
  Bottom 0.305: U$10.P$21 56.04,64.52 C7.1
N$59
  Bottom 0.305: C6.2 61.12,64.99 U$10.P$19
N$60
  Bottom 0.305: U$10.P$18 63.66,64.52 C7.2
N$61
  Bottom 0.305: C8.2 65.69,64.17 U$10.P$17 67.25,63.66 R9.2
N$62  (via drill 0.38)
  Top 0.305: v0.95,37.47 0.95,38.58 LED16.4
  Bottom 0.305: U$51.7 5.88,43.51 3.02,40.64 3.02,39.53 v0.95,37.47
N$63  (via drill 0.38)
  Top 0.305: v2.06,40.48 1.75,40.16 1.43,40.16 1.08,39.81 LED16.3
  Bottom 0.305: U$51.8 5.23,43.65 v2.06,40.48
N$64  (via drill 0.38)
  Top 0.305: v1.91,42.07 3.78,43.95 LED17.1
  Bottom 0.305: U$51.9 4.58,44.74 v1.91,42.07
N$65  (via drill 0.38)
  Top 0.305: v0.79,43.02 0.79,43.82 LED17.4
  Bottom 0.305: U$51.11 3.28,46.14 2.38,45.24 1.27,45.24 0.79,44.77 v0.79,43.02
N$66  (via drill 0.38)
  Top 0.305: v0.79,46.2 0.79,45.4 LED17.3
  Bottom 0.305: U$51.12 2.63,46.29 2.38,46.04 0.95,46.04 v0.79,46.2
N$67  (via drill 0.38)
  Top 0.305: v2.7,49.37 3.75,49.37 LED18.1
  Bottom 0.305: U$51.13 1.98,48.65 v2.7,49.37
N$68  (via drill 0.38)
  Top 0.305: v0.95,48.26 0.95,49.38 LED18.4
  Bottom 0.305: U$51.14 1.33,47.88 v0.95,48.26
N$69  (via drill 0.38)
  Top 0.305: v1.11,51.75 1.11,50.74 LED18.3
  Bottom 0.305: U$51.15 1.33,51.97 v1.11,51.75
N$70  (via drill 0.38)
  Top 0.305: v2.38,51.75 3.33,51.75 3.81,52.23 3.81,54.77 LED19.1
  Bottom 0.305: U$51.16 1.98,52.15 v2.38,51.75
N$71  (via drill 0.38)
  Top 0.305: v1.91,54.77 1.02,54.77 LED19.4
  Bottom 0.305: U$51.17 2.63,54.04 v1.91,54.77
N$72  (via drill 0.38)
  Top 0.305: v1.91,55.88 1.1,55.88 LED19.3
  Bottom 0.305: U$51.18 3.28,54.5 v1.91,55.88
N$73  (via drill 0.38)
  Top 0.305: v3.81,57.78 3.81,60.17 LED20.1
  Bottom 0.305: U$51.20 4.58,57.01 v3.81,57.78
N$74  (via drill 0.38)
  Top 0.305: v1.91,60.17 1.02,60.17 LED20.4
  Bottom 0.305: U$51.21 5.23,57.48 2.54,60.17 v1.91,60.17
N$75  (via drill 0.38)
  Top 0.305: v2.06,61.44 1.02,61.44 LED20.3
  Bottom 0.305: U$51.22 5.88,57.62 v2.06,61.44
N$76
  Bottom 0.305: U$51.1 10.86,47.09 R15.1
N$77
  Bottom 0.61: U3.4 64.96,22.7 C26.1
N$78
  Bottom 0.61: U3.3 64.58,21.43 R22.2 62.87,23.15 R23.1
N$79
  Bottom 0.61: U3.1 67.63,18.89 68.26,18.26 68.26,17.18 C27.2
N$80
  Bottom 0.61: C27.1 69.85,17.18 69.85,18.41 70.33,18.89 U3.8 74.3,18.89 74.84,18.34 D2.C 84.14,22.7 82.55,24.29 82.55,25.4 83.66,26.51 83.66,34.61 84.93,35.88 86.33,35.88 L2.P$1 85.72,35.27
N$81
  Bottom 0.61: C28.2 R66.1
N$82
  Bottom 0.61: U3.6 73.63,21.43 C28.1 C29.1
N$83
  Bottom 0.61: R69.1 R68.2 69.72,23.15 70.17,22.7 U3.5
N$84
  pour Bottom (no thermals): 57.63,23.02 57.63,21.11 56.67,20.16 56.67,18.73 56.83,18.57 60.33,18.57 60.48,18.73 60.48,20.16 60.8,20.48 60.8,23.02 60.64,23.18 57.78,23.18
N$85
  Bottom 0.305: R26.2 16.64,57.31 22.07,57.31 22.7,56.67 22.7,54.93 23.06,54.57 SW1.P$4
N$86
  Bottom 0.305: 14.64,56.99 R26.1 | 14.64,56.99 R11.2 | C11.1 14.48,57.02 14.64,56.99
N$87  (via drill 0.38)
  Top 0.305: v91.6,62.07 91.19,62.07 LED21.1
  Bottom 0.305: U$8.6 87.77,55.38 91.76,59.37 91.76,60.8 91.6,60.96 v91.6,62.07
N$88  (via drill 0.38)
  Top 0.305: v92.39,61.28 93.19,61.28 LED21.4
  Bottom 0.305: U$8.7 88.42,55.24 92.39,59.21 v92.39,61.28
N$89  (via drill 0.38)
  Top 0.305: v93.19,59.21 93.19,60.07 LED21.3
  Bottom 0.305: U$8.8 89.07,55.09 v93.19,59.21
N$90  (via drill 0.38)
  Top 0.305: v91.92,56.99 91.5,56.99 LED22.1
  Bottom 0.305: U$8.9 89.72,54.79 v91.92,56.99
N$91  (via drill 0.38)
  Top 0.305: v92.23,55.88 93.19,55.88 LED22.4
  Bottom 0.305: U$8.11 91.02,54.66 v92.23,55.88
N$92  (via drill 0.38)
  Top 0.305: v92.23,54.77 93.28,54.77 LED22.3
  Bottom 0.305: U$8.12 91.67,54.2 v92.23,54.77
N$93  (via drill 0.38)
  Top 0.305: v91.6,51.28 91.19,51.28 LED23.1
  Bottom 0.305: U$8.13 92.32,51.99 v91.6,51.28
N$94  (via drill 0.38)
  Top 0.305: v93.19,51.75 93.19,50.74 LED23.4
  Bottom 0.305: U$8.14 92.97,51.97 v93.19,51.75
N$95  (via drill 0.38)
  Top 0.305: v93.34,48.26 93.34,49.38 LED23.3
  Bottom 0.305: U$8.15 92.97,47.88 v93.34,48.26
N$96  (via drill 0.38)
  Top 0.305: v91.92,48.26 90.52,46.86 LED24.1
  Bottom 0.305: U$8.16 92.32,47.86 v91.92,48.26
N$97  (via drill 0.38)
  Top 0.305: v92.39,45.72 92.81,45.72 LED24.4
  Bottom 0.305: U$8.17 91.67,46.45 v92.39,45.72
N$98  (via drill 0.38)
  Top 0.305: v92.23,44.13 93.19,44.13 LED24.3
  Bottom 0.305: U$8.18 91.02,45.35 v92.23,44.13
N$99  (via drill 0.38)
  Top 0.305: 90.64,39.69 LED25.1 90.52,41.46 v92.08,43.02
  Bottom 0.305: U$8.20 89.72,45.54 92.08,43.18 v92.08,43.02
N$100  (via drill 0.38)
  Top 0.305: v93.19,41.91 93.19,39.94 LED25.4
  Bottom 0.305: U$8.21 89.07,45.4 91.12,43.34 91.12,42.86 92.08,41.91 v93.19,41.91
N$101  (via drill 0.38)
  Top 0.305: v92.08,41.12 92.08,39.05 92.39,38.73 93.19,38.73 LED25.3
  Bottom 0.305: U$8.22 88.42,45.25 90.65,43.02 90.65,42.55 v92.08,41.12
N$102
  Bottom 0.305: U$8.1 83.44,52.92 R10.1
N$103  (via drill 0.38)
  Top 0.305: v55.09,41.43 55.09,35.72 37.15,17.78 v37.15,15.56
  Bottom 0.305: X2.2 55.08,41.28 v55.09,41.43 | U$4.2 v37.15,15.56
N$105  (via drill 0.38)
  Top 0.305: v33.18,41.43 33.18,39.69 22.54,29.05 v22.54,25.4
  Bottom 0.305: X3.3 33.18,42.55 v33.18,41.43 | v22.54,25.4 U$5.3
N$106  (via drill 0.38)
  Top 0.305: v34.13,41.43 34.13,39.85 23.81,29.53 v23.81,25.4
  Bottom 0.305: X3.4 34.13,42.5 v34.13,41.43 | U$5.4 v23.81,25.4
N$107  (via drill 0.38)
  Top 0.305: v35.24,41.43 35.24,40.16 25.08,30 v25.08,25.4
  Bottom 0.305: X3.5 35.24,42.56 v35.24,41.43 | U$5.5 v25.08,25.4
N$108  (via drill 0.38)
  Top 0.305: v36.2,41.43 36.2,40.32 26.35,30.48 v26.35,25.4
  Bottom 0.305: X3.6 36.2,42.56 v36.2,41.43 | U$5.6 v26.35,25.4
N$109  (via drill 0.38)
  Top 0.305: v37.15,41.43 37.15,40.48 27.62,30.96 v27.62,25.4
  Bottom 0.305: X3.7 37.15,42.52 v37.15,41.43 | U$5.7 v27.62,25.4
N$110  (via drill 0.38)
  Top 0.305: v38.26,41.43 38.26,40.8 28.89,31.43 v28.89,25.4
  Bottom 0.305: X3.8 38.26,42.55 v38.26,41.43 | U$5.8 v28.89,25.4
N$111  (via drill 0.38)
  Top 0.305: v39.21,41.43 39.21,40.96 30.16,31.91 v30.16,25.4
  Bottom 0.305: X3.9 v39.21,41.43 | U$5.9 v30.16,25.4
N$112  (via drill 0.38)
  Top 0.305: v56.04,41.43 56.04,35.88 38.42,18.26 v38.42,15.56
  Bottom 0.305: X2.3 56.08,41.47 v56.04,41.43 | U$4.3 v38.42,15.56
N$113  (via drill 0.38)
  Top 0.305: v56.99,41.43 56.99,36.04 39.69,18.73 v39.69,15.56
  Bottom 0.305: X2.4 57.08,41.52 v56.99,41.43 | U$4.4 v39.69,15.56
N$114  (via drill 0.38)
  Top 0.305: v58.1,41.43 58.1,36.35 40.96,19.21 v40.96,15.56
  Bottom 0.305: X2.5 58.08,41.46 v58.1,41.43 | U$4.5 v40.96,15.56
N$115  (via drill 0.38)
  Top 0.305: v59.05,41.43 59.05,36.51 42.23,19.68 v42.23,15.56
  Bottom 0.305: X2.6 59.08,41.46 v59.05,41.43 | U$4.6 v42.23,15.56
N$119
  Bottom 0.305: SW1.P$3 21.71,54.57 22.07,54.93 22.07,56.36 21.75,56.67 16.64,56.67 R11.1
RESET
  Bottom 0.305: JTAG1.15 4.6,32.23 12.54,32.23 13.97,33.66 43.02,33.66 45.12,31.56 J1.90
SCL  (via drill 0.33, 0.38)
  Top 0.305: v30.48,60.33 31.27,60.33 31.43,60.48 45.09,60.48 45.72,59.85 47.78,59.85 v47.94,59.69 48.9,59.69 49.05,59.85 49.69,59.85 51.91,62.07 66.99,62.07 68.74,63.82 74.14,63.82 74.3,63.98 v75.25,63.98 76.2,63.98 76.36,64.14 83.19,64.14 86.36,60.96 86.36,49.37 v86.04,49.05 | v21.59,62.23 20.8,62.23 20.64,62.07 10.48,62.07 8.57,60.17 8.57,51.44 v8.41,51.28 8.41,38.89 9.05,38.26 23.5,38.26 24.92,39.69 v25.4,39.69 | v89.53,31.75 85.41,35.88 v85.41,44.29
  Bottom 0.305: v86.04,49.05 85.82,48.83 U$8.26 85.82,45.78 R8.1 85.44,44.32 v85.41,44.29 | U$36.26 76.11,62.16 75.25,63.02 v75.25,63.98 | U$33.26 48.8,54.7 47.94,55.56 v47.94,59.69 | v30.48,60.33 28.89,60.33 27.05,62.16 U$30.26 21.66,62.16 v21.59,62.23 | U$51.26 8.48,51.34 v8.41,51.28 | J1.37 25.62,39.47 v25.4,39.69 | X6.10 89.85,18.41 90.96,17.3 91.92,17.3 92.55,17.94 92.55,18.73 93.19,19.37 93.19,30.64 92.55,31.27 90.01,31.27 v89.53,31.75
SDA  (via drill 0.33, 0.38)
  Top 0.305: v85.09,48.9 85.09,49.21 85.88,50.01 85.88,60.64 82.87,63.66 76.68,63.66 76.36,63.34 v74.61,63.34 69.06,63.34 67.31,61.59 52.23,61.59 50.01,59.37 49.37,59.37 49.21,59.21 48.42,59.21 48.26,59.05 v47.31,59.05 46.99,59.37 45.4,59.37 44.77,60.01 31.75,60.01 31.43,59.69 v31.11,59.69 | v21.11,61.59 10.79,61.59 9.05,59.85 v9.05,50.8 8.89,50.64 8.89,39.21 9.37,38.73 23.18,38.73 24.92,40.48 25.56,40.48 v26.35,39.69 | v89.53,30.8 83.82,36.51 v83.82,44.29
  Bottom 0.305: v85.09,48.9 85.17,48.82 U$8.27 85.17,46.43 84.93,46.2 84.58,46.2 R7.1 83.79,44.32 v83.82,44.29 | U$36.27 75.97,61.51 74.61,62.87 v74.61,63.34 | U$33.27 48.66,54.05 47.31,55.4 v47.31,59.05 | v31.11,59.69 30.16,59.69 30,59.85 28.57,59.85 26.91,61.51 U$30.27 21.2,61.51 v21.11,61.59 | v9.05,50.8 9.13,50.88 U$51.27 | J1.39 26.22,39.55 v26.35,39.69 | X6.9 92.71,19.68 92.71,30.32 92.23,30.8 v89.53,30.8
SW1  (via drill 0.33)
  Top 0.305: v18.89,35.4 18.89,36.2 19.53,36.83 29.53,36.83 32.23,39.53 v32.23,41.43
  Bottom 0.305: J1.17 19.62,36.92 18.89,36.2 v18.89,35.4 | v32.23,41.43 32.22,41.44 X3.2
SW2  (via drill 0.33, 0.38)
  Top 0.305: v22.54,18.26 21.27,19.53 18.73,19.53 17.46,20.8 17.3,32.86 19.68,35.24 v19.68,35.72
  Bottom 0.305: U$5.18 v22.54,18.26 | J1.19 20.22,36.73 19.68,36.2 v19.68,35.72
SW3  (via drill 0.33, 0.38)
  Top 0.305: v23.81,18.26 22.07,20 19.05,20 17.94,21.11 17.78,32.54 20.48,35.24 v20.48,35.4
  Bottom 0.305: U$5.17 v23.81,18.26 | J1.21 20.82,36.53 20.48,36.2 v20.48,35.4
SW4  (via drill 0.33, 0.38)
  Top 0.305: v25.08,18.26 22.86,20.48 19.37,20.48 18.41,21.43 18.26,32.23 21.27,35.24 v21.27,35.72
  Bottom 0.305: U$5.16 v25.08,18.26 | J1.23 21.42,35.86 v21.27,35.72
SW5  (via drill 0.33, 0.38)
  Top 0.305: v26.35,18.26 23.65,20.95 19.68,20.95 18.89,21.75 18.73,31.91 22.07,35.24 v22.07,35.4
  Bottom 0.305: U$5.15 v26.35,18.26 | J1.25 22.02,35.45 v22.07,35.4
SW6  (via drill 0.33, 0.38)
  Top 0.305: v27.62,18.26 24.45,21.43 20,21.43 19.37,22.07 19.21,31.59 22.86,35.24 v22.86,35.72
  Bottom 0.305: U$5.14 v27.62,18.26 | J1.27 22.62,35.96 v22.86,35.72
SW7  (via drill 0.33, 0.38)
  Top 0.305: v28.89,18.26 25.24,21.91 20.32,21.91 19.84,22.38 19.68,31.27 23.65,35.24 v23.65,35.4
  Bottom 0.305: U$5.13 v28.89,18.26 | J1.29 23.22,36.63 23.65,36.2 v23.65,35.4
SW8  (via drill 0.33, 0.38)
  Top 0.305: v30.16,18.26 26.04,22.38 20.64,22.38 20.32,22.7 20.16,30.96 24.45,35.24 v24.45,35.72
  Bottom 0.305: U$5.12 v30.16,18.26 | J1.31 23.82,36.98 24.45,36.35 v24.45,35.72
VCC  (via drill 0.6)
  Top 0.61: 59.69,25.24 v58.58,25.24 | v77.79,43.34 59.69,25.24 | X6.3 90.17,24.77 88.11,24.77 86.2,22.86 62.07,22.86 59.69,25.24
  Bottom 0.61: v77.79,43.34 76.61,43.34 CN1.1
  pour Bottom (no thermals): 56.52,28.1 56.36,27.94 56.36,26.04 57.94,24.45 59.21,24.45 60.8,26.04 60.8,27.94 60.64,28.1
~RESET  (via drill 0.33, 0.38)
  Top 0.305: v30.96,60.96 45.4,60.96 46.04,60.33 v48.58,60.33 49.37,60.33 51.59,62.55 66.67,62.55 68.42,64.29 73.82,64.29 74.14,64.61 v75.88,64.61 83.5,64.61 86.84,61.28 v86.84,48.74 | v20.95,62.87 20.64,62.87 20.32,62.55 10.16,62.55 8.1,60.48 8.1,51.91 7.62,51.44 v7.62,50.8 7.94,50.48 7.94,38.58 8.73,37.78 13.65,37.78 v13.97,37.47
  Bottom 0.305: U$8.25 86.47,48.37 v86.84,48.74 | U$36.25 76.25,62.81 75.88,63.18 v75.88,64.61 | U$33.25 48.95,55.35 48.58,55.72 v48.58,60.33 | v30.96,60.96 29.05,60.96 27.2,62.81 U$30.25 21.96,62.81 21.91,62.87 v20.95,62.87 | U$51.25 7.83,51.65 7.62,51.44 v7.62,50.8 | J1.1 14.1,38.07 13.97,37.94 v13.97,37.47

## Text on the board
bPlace: Dashboard / Version 3